# Altium project LEAKCAM.PrjPcb (part 1 of 2)
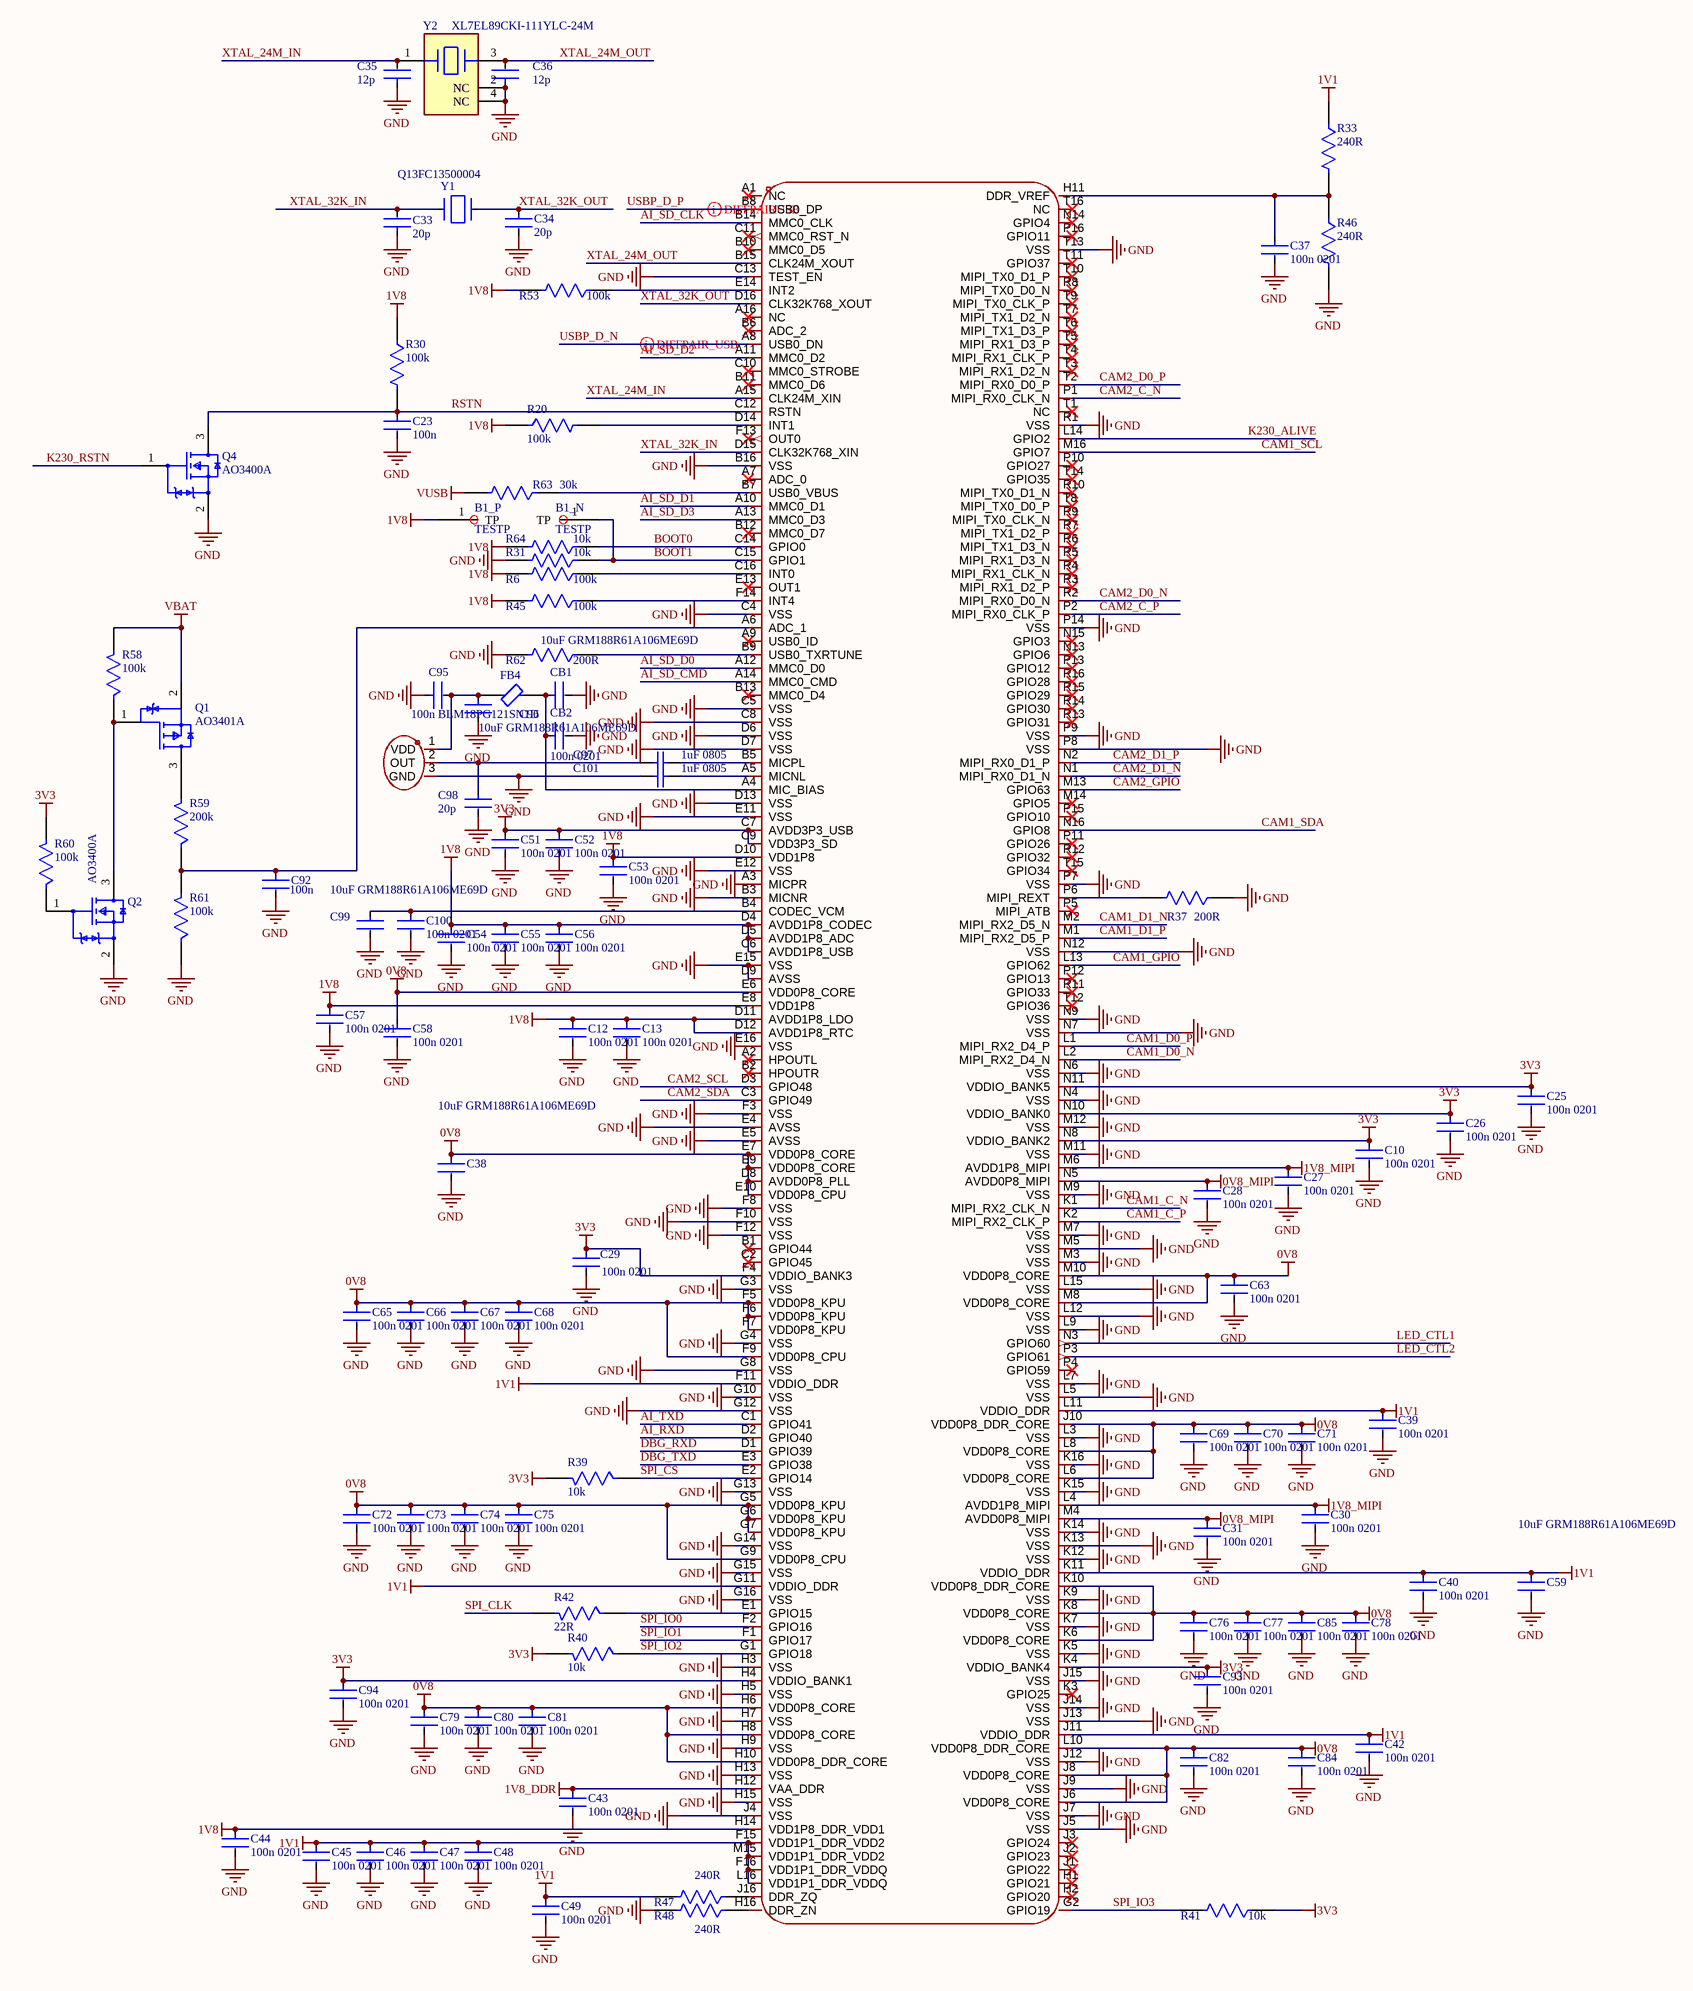
[diagram p0: LEAKCAM.SchDoc]
8 sheets, 269 parts. Net scope: global (net labels, ports and power ports of the same name join across sheets).
Board file: MIFA.PcbDoc
Sheets:
  LEAKCAM.SchDoc
  POWER.SchDoc
  FLASH.SchDoc
  DBG.SchDoc
  CAM.SchDoc
  WIFI.SchDoc
  LEDS.SchDoc
  SENS.SchDoc

## Sheet LEAKCAM.SchDoc
size A2; SheetNumber: 1; SheetTotal: 8

### Parts
B1_N  TESTP  [TESTP]
B1_P  TESTP  [TESTP]
C10  100n 0201  [CAP_0201]
C12  100n 0201  [CAP_0201]
C13  100n 0201  [CAP_0201]
C23  100n  [CAP_0402]
C25  100n 0201  [CAP_0201]
C26  100n 0201  [CAP_0201]
C27  100n 0201  [CAP_0201]
C28  100n 0201  [CAP_0201]
C29  100n 0201  [CAP_0201]
C30  100n 0201  [CAP_0201]
C31  100n 0201  [CAP_0201]
C33  20p  [CAP_0402]
C34  20p  [CAP_0402]
C35  12p  [CAP_0402]
C36  12p  [CAP_0402]
C37  100n 0201  [CAP_0201]
C38  10uF GRM188R61A106ME69D  [FP-GRM188-0_15-MFG]
C39  100n 0201  [CAP_0201]
C40  100n 0201  [CAP_0201]
C42  100n 0201  [CAP_0201]
C43  100n 0201  [CAP_0201]
C44  100n 0201  [CAP_0201]
C45  100n 0201  [CAP_0201]
C46  100n 0201  [CAP_0201]
C47  100n 0201  [CAP_0201]
C48  100n 0201  [CAP_0201]
C49  100n 0201  [CAP_0201]
C51  100n 0201  [CAP_0201]
C52  100n 0201  [CAP_0201]
C53  100n 0201  [CAP_0201]
C54  100n 0201  [CAP_0201]
C55  100n 0201  [CAP_0201]
C56  100n 0201  [CAP_0201]
C57  100n 0201  [CAP_0201]
C58  100n 0201  [CAP_0201]
C59  10uF GRM188R61A106ME69D  [FP-GRM188-0_15-MFG]
C63  100n 0201  [CAP_0201]
C65  100n 0201  [CAP_0201]
C66  100n 0201  [CAP_0201]
C67  100n 0201  [CAP_0201]
C68  100n 0201  [CAP_0201]
C69  100n 0201  [CAP_0201]
C70  100n 0201  [CAP_0201]
C71  100n 0201  [CAP_0201]
C72  100n 0201  [CAP_0201]
C73  100n 0201  [CAP_0201]
C74  100n 0201  [CAP_0201]
C75  100n 0201  [CAP_0201]
C76  100n 0201  [CAP_0201]
C77  100n 0201  [CAP_0201]
C78  100n 0201  [CAP_0201]
C79  100n 0201  [CAP_0201]
C80  100n 0201  [CAP_0201]
C81  100n 0201  [CAP_0201]
C82  100n 0201  [CAP_0201]
C84  100n 0201  [CAP_0201]
C85  100n 0201  [CAP_0201]
C92  100n  [CAP_0402]
C93  100n 0201  [CAP_0201]
C94  100n 0201  [CAP_0201]
C95  100n  [CAP_0402]
C96  10uF GRM188R61A106ME69D  [FP-GRM188-0_15-MFG]
C97  1uF 0805  [CAPC2013X145X50NL20T20]
C98  20p  [CAP_0402]
C99  10uF GRM188R61A106ME69D  [FP-GRM188-0_15-MFG]
C100  100n 0201  [CAP_0201]
C101  1uF 0805  [CAPC2013X145X50NL20T20]
CB1  10uF GRM188R61A106ME69D  [FP-GRM188-0_15-MFG]
CB2  100n 0201  [CAP_0201]
FB4  BLM18PG121SN1D  [FP-BLM18-0_15-t0_8-IPC_B]
Q1  AO3401A  [FP-SOT23-IPC_B]
Q2  AO3400A  [FP-SOT23-MFG]
Q4  AO3400A  [FP-SOT23-MFG]
R6  100k  [RES_0402]
R20  100k  [RES_0402]
R30  100k  [RES_0402]
R31  10k  [RES_0402]
R33  240R  [RES_0402]
R37  200R  [RES_0402]
R39  10k  [RES_0402]
R40  10k  [RES_0402]
R41  10k  [RES_0402]
R42  22R  [RES_0402]
R45  100k  [RES_0402]
R46  240R  [RES_0402]
R47  240R  [RES_0402]
R48  240R  [RES_0402]
R53  100k  [RES_0402]
R58  100k  [RES_0402]
R59  200k  [RES_0402]
R60  100k  [RES_0402]
R61  100k  [RES_0402]
R62  200R  [RES_0402]
R63  30k  [RES_0402]
R64  10k  [RES_0402]
U3  k230d  [K230D]  (value not drawn)
U13  msm381acb026  [mems]  (value not drawn)
Y1  Q13FC13500004  [FP-ABS07-MFG]
Y2  XL7EL89CKI-111YLC-24M  [FP-XRCGB_F_N-MFG]

### Nets
0V8: C38.1 C58.1 C63.1 C65.1 C66.1 C67.1 C68.1 C69.1 C70.1 C71.1 C72.1 C73.1 C74.1 C75.1 C76.1 C77.1 C78.1 C79.1 C80.1 C81.1 C82.1 C84.1 C85.1 U3.D8(AVDD0P8_PLL) U3.E6(VDD0P8_CORE) U3.E7(VDD0P8_CORE) U3.E9(VDD0P8_CORE) U3.E10(VDD0P8_CPU) U3.F5(VDD0P8_KPU) U3.F6(VDD0P8_KPU) U3.F7(VDD0P8_KPU) U3.F9(VDD0P8_CPU) U3.G5(VDD0P8_KPU) U3.G6(VDD0P8_KPU) U3.G7(VDD0P8_KPU) U3.G9(VDD0P8_CPU) U3.H6(VDD0P8_CORE) U3.H8(VDD0P8_CORE) U3.H10(VDD0P8_DDR_CORE) U3.J6(VDD0P8_CORE) U3.J8(VDD0P8_CORE) U3.J10(VDD0P8_DDR_CORE) U3.K6(VDD0P8_CORE) U3.K8(VDD0P8_CORE) U3.K10(VDD0P8_DDR_CORE) U3.L6(VDD0P8_CORE) U3.L8(VDD0P8_CORE) U3.L10(VDD0P8_DDR_CORE) U3.M8(VDD0P8_CORE) U3.M10(VDD0P8_CORE)
0V8_MIPI: C28.1 C31.1 U3.M4(AVDD0P8_MIPI) U3.N5(AVDD0P8_MIPI)
1V1: C39.1 C40.1 C42.1 C45.1 C46.1 C47.1 C48.1 C49.1 C59.1 R33.1 R47.2 U3.F11(VDDIO_DDR) U3.F15(VDD1P1_DDR_VDD2) U3.F16(VDD1P1_DDR_VDDQ) U3.G11(VDDIO_DDR) U3.J11(VDDIO_DDR) U3.K11(VDDIO_DDR) U3.L11(VDDIO_DDR) U3.L16(VDD1P1_DDR_VDDQ) U3.M15(VDD1P1_DDR_VDD2)
1V8: B1_P.1(TP) C12.1 C13.1 C44.1 C53.1 C54.1 C55.1 C56.1 C57.1 R6.2 R20.1 R30.1 R45.2 R53.2 R64.2 U3.C6(AVDD1P8_USB) U3.D4(AVDD1P8_CODEC) U3.D5(AVDD1P8_ADC) U3.D10(VDD1P8) U3.D11(AVDD1P8_LDO) U3.D12(AVDD1P8_RTC) U3.E8(VDD1P8) U3.H14(VDD1P8_DDR_VDD1)
1V8_DDR: C43.1 U3.H12(VAA_DDR)
1V8_MIPI: C27.1 C30.1 U3.L4(AVDD1P8_MIPI) U3.M6(AVDD1P8_MIPI)
3V3: C10.1 C25.1 C26.1 C29.1 C51.1 C52.1 C93.1 C94.1 R39.2 R40.2 R41.1 R60.2 U3.C7(AVDD3P3_USB) U3.C9(VDD3P3_SD) U3.F4(VDDIO_BANK3) U3.H4(VDDIO_BANK1) U3.K4(VDDIO_BANK4) U3.N8(VDDIO_BANK2) U3.N10(VDDIO_BANK0) U3.N11(VDDIO_BANK5)
GND: C10.2 C12.2 C13.2 C23.2 C25.2 C26.2 C27.2 C28.2 C29.2 C30.2 C31.2 C33.1 C34.2 C35.1 C36.1 C37.2 C38.2 C39.2 C40.2 C42.2 C43.2 C44.2 C45.2 C46.2 C47.2 C48.2 C49.2 C51.2 C52.2 C53.2 C54.2 C55.2 C56.2 C57.2 C58.2 C59.2 C63.2 C65.2 C66.2 C67.2 C68.2 C69.2 C70.2 C71.2 C72.2 C73.2 C74.2 C75.2 C76.2 C77.2 C78.2 C79.2 C80.2 C81.2 C82.2 C84.2 C85.2 C92.2 C93.2 C94.2 C95.1 C96.2 C98.2 C99.2 C100.2 C101.1 CB1.2 CB2.2 Q2.2(S) Q4.2(S) R31.2 R37.1 R46.2 R48.2 R61.1 R62.2 U3.A3(MICPR) U3.B3(MICNR) U3.B16(VSS) U3.C4(VSS) U3.C5(VSS) U3.C8(VSS) U3.C13(TEST_EN) U3.D6(VSS) U3.D7(VSS) U3.D9(AVSS) U3.D13(VSS) U3.E4(AVSS) U3.E5(AVSS) U3.E11(VSS) U3.E12(VSS) U3.E15(VSS) U3.E16(VSS) U3.F3(VSS) U3.F8(VSS) U3.F10(VSS) U3.F12(VSS) U3.G3(VSS) U3.G4(VSS) U3.G8(VSS) U3.G10(VSS) U3.G12(VSS) U3.G13(VSS) U3.G14(VSS) U3.G15(VSS) U3.G16(VSS) U3.H3(VSS) U3.H5(VSS) U3.H7(VSS) U3.H9(VSS) U3.H13(VSS) U3.H15(VSS) U3.J4(VSS) U3.J5(VSS) U3.J7(VSS) U3.J9(VSS) U3.J12(VSS) U3.J13(VSS) U3.J14(VSS) U3.J15(VSS) U3.K5(VSS) U3.K7(VSS) U3.K9(VSS) U3.K12(VSS) U3.K13(VSS) U3.K14(VSS) U3.K15(VSS) U3.K16(VSS) U3.L3(VSS) U3.L5(VSS) U3.L7(VSS) U3.L9(VSS) U3.L12(VSS) U3.L15(VSS) U3.M3(VSS) U3.M5(VSS) U3.M7(VSS) U3.M9(VSS) U3.M11(VSS) U3.M12(VSS) U3.N4(VSS) U3.N6(VSS) U3.N7(VSS) U3.N9(VSS) U3.N12(VSS) U3.P7(VSS) U3.P8(VSS) U3.P9(VSS) U3.P14(VSS) U3.R1(VSS) U3.T13(VSS) U13.3(GND) Y2.2(NC) Y2.4(NC)
VBAT: Q1.2(S) R58.2
VUSB: R63.2
AI_RXD: U3.D2(GPIO40)
AI_SD_CLK: U3.B14(MMC0_CLK)
AI_SD_CMD: U3.A14(MMC0_CMD)
AI_SD_D0: U3.A12(MMC0_D0)
AI_SD_D1: U3.A10(MMC0_D1)
AI_SD_D2: U3.A11(MMC0_D2)
AI_SD_D3: U3.A13(MMC0_D3)
AI_TXD: U3.C1(GPIO41)
BOOT0: R64.1 U3.C14(GPIO0)
BOOT1: B1_N.1(TP) R31.1 U3.C15(GPIO1)
CAM1_C_N: U3.K1(MIPI_RX2_CLK_N)
CAM1_C_P: U3.K2(MIPI_RX2_CLK_P)
CAM1_D0_N: U3.L2(MIPI_RX2_D4_N)
CAM1_D0_P: U3.L1(MIPI_RX2_D4_P)
CAM1_D1_N: U3.M2(MIPI_RX2_D5_N)
CAM1_D1_P: U3.M1(MIPI_RX2_D5_P)
CAM1_GPIO: U3.L13(GPIO62)
CAM1_SCL: U3.M16(GPIO7)
CAM1_SDA: U3.N16(GPIO8)
CAM2_C_N: U3.P1(MIPI_RX0_CLK_N)
CAM2_C_P: U3.P2(MIPI_RX0_CLK_P)
CAM2_D0_N: U3.R2(MIPI_RX0_D0_N)
CAM2_D0_P: U3.T2(MIPI_RX0_D0_P)
CAM2_D1_N: U3.N1(MIPI_RX0_D1_N)
CAM2_D1_P: U3.N2(MIPI_RX0_D1_P)
CAM2_GPIO: U3.M13(GPIO63)
CAM2_SCL: U3.D3(GPIO48)
CAM2_SDA: U3.C3(GPIO49)
DBG_RXD: U3.D1(GPIO39)
DBG_TXD: U3.E3(GPIO38)
K230_ALIVE: U3.L14(GPIO2)
K230_RSTN: Q4.1(G)
LED_CTL1: U3.N3(GPIO60)
LED_CTL2: U3.P3(GPIO61)
RSTN: C23.1 Q4.3(D) R30.2 U3.C12(RSTN)
SPI_CLK: R42.2
SPI_CS: R39.1 U3.E2(GPIO14)
SPI_IO0: U3.F2(GPIO16)
SPI_IO1: U3.F1(GPIO17)
SPI_IO2: R40.1 U3.G1(GPIO18)
SPI_IO3: R41.2 U3.G2(GPIO19)
USBP_D_N: U3.A8(USB0_DN)
USBP_D_P: U3.B8(USB0_DP)
XTAL_24M_IN: C35.2 U3.A15(CLK24M_XIN) Y2.1(1_Input/Output)
XTAL_24M_OUT: C36.2 U3.B15(CLK24M_XOUT) Y2.3(2_Input/Output)
XTAL_32K_IN: C33.2 U3.D15(CLK32K768_XIN) Y1.1
XTAL_32K_OUT: C34.1 U3.D16(CLK32K768_XOUT) Y1.2
NetC37_1: C37.1 R33.2 R46.1 U3.H11(DDR_VREF)
NetC92_1: C92.1 R59.1 R61.2 U3.A6(ADC_1)
NetC95_2: C95.2 C96.1 FB4.1 U13.1(VDD)
NetC97_1: C97.1 C98.1 U13.2(OUT)
NetC97_2: C97.2 U3.B5(MICPL)
NetC99_1: C99.1 C100.1 U3.B4(CODEC_VCM)
NetC101_2: C101.2 U3.A5(MICNL)
NetCB1_1: CB1.1 CB2.1 FB4.2 U3.A4(MIC_BIAS)
NetQ1_1: Q1.1(G) Q2.3(D) R58.1
NetQ1_3: Q1.3(D) R59.2
NetQ2_1: Q2.1(G) R60.1
NetR6_1: R6.1 U3.C16(INT0)
NetR20_2: R20.2 U3.D14(INT1)
NetR37_2: R37.2 U3.P6(MIPI_REXT)
NetR42_1: R42.1 U3.E1(GPIO15)
NetR45_1: R45.1 U3.F14(INT4)
NetR47_1: R47.1 U3.J16(DDR_ZQ)
NetR48_1: R48.1 U3.H16(DDR_ZN)
NetR53_1: R53.1 U3.E14(INT2)
NetR62_1: R62.1 U3.B9(USB0_TXRTUNE)
NetR63_1: R63.1 U3.B7(USB0_VBUS)

Not connected (* = marked no-connect by the designer): U3 A1(NC)* A2(HPOUTL)* A7(ADC_0)* A9(USB0_ID)* A16(NC)* B1(GPIO44)* B2(HPOUTR)* B6(ADC_2)* B10(MMC0_D5)* B11(MMC0_D6)* B12(MMC0_D7)* B13(MMC0_D4)* C2(GPIO45)* C10(MMC0_STROBE)* C11(MMC0_RST_N)* E13(OUT1)* F13(OUT0)* H1(GPIO21)* H2(GPIO20)* J1(GPIO22)* J2(GPIO23)* J3(GPIO24)* K3(GPIO25)* M14(GPIO5)* N13(GPIO6)* N14(GPIO4)* N15(GPIO3)* P4(GPIO59)* P5(MIPI_ATB)* P10(GPIO27)* P11(GPIO26)* P12(GPIO13)* P13(GPIO12)* P15(GPIO10)* P16(GPIO11)* R3(MIPI_RX1_D2_P)* R4(MIPI_RX1_CLK_N)* R5(MIPI_RX1_D3_N)* R6(MIPI_TX1_D3_N)* R7(MIPI_TX1_D2_P)* R8(MIPI_TX0_D0_N)* R9(MIPI_TX0_CLK_N)* R10(MIPI_TX0_D1_N)* R11(GPIO33)* R12(GPIO32)* R13(GPIO31)* R14(GPIO30)* R15(GPIO29)* R16(GPIO28)* T1(NC)* T3(MIPI_RX1_D2_N)* T4(MIPI_RX1_CLK_P)* T5(MIPI_RX1_D3_P)* T6(MIPI_TX1_D3_P)* T7(MIPI_TX1_D2_N)* T8(MIPI_TX0_D0_P)* T9(MIPI_TX0_CLK_P)* T10(MIPI_TX0_D1_P)* T11(GPIO37)* T12(GPIO36)* T14(GPIO35)* T15(GPIO34)* T16(NC)*

### Layout directives
differential pair; differential pair class USB: USBP_D_N, USBP_D_P

### Library data of the parts
C10 C12 C13 C25-C31 C37 C39 C40 C42-C49 C51-C58 C63 C65-C82 C84 C85 C93 C94 C100 = CMP-03422-001116-1: C2903663; Manufacturer: Yageo; Manufacturer Part Number: CC0201KRX5R7BB223; Material: Ceramic; Tolerance: 0.1; Temperature Coefficient: 15%; Temperature Characteristic: X5R; Value: 100nF; Voltage Rating: 16 V; Automotive: No; Device Class L1: Passive Components; Lead Free: Yes; ComponentLink2URL: http://www.yageo.com/documents/recent/UPY-GPHC_X5R_4V-to-50V_25.pdf; RoHS: TRUE; Height: 0.33mm; Capacitance: 100nF; Package: CC0201-BA; Temperature Range Low: -55°C; Footprint Url: http://www.yageo.com/exep/pages/download/literatures/UPY-C_GEN_24.pdf; Temperature Range High: +85°C; ComponentLink2Description: Datasheet; Device Class L3: Ceramic Capacitors; Ipc Land Pattern Name: CAPC6030X30; Temperature: -55°C to +85°C; Category: Cap; Device Class L2: Capacitors; Octopart: https://octopart.com/cc0201krx5r7bb223-yageo-90326712
C23 C92 C95 = CMP-03422-001116-1: C307331; Tolerance: 10%; Voltage Rating: 50V; Capacitance: 100nF; Value: 100nF; Max Operating Temperature: 125°C; Case Code (Metric): 1005; RoHS Compliant: Yes; Series: -; Case Code (Imperial): 0402; Min Operating Temperature: -55°C; Mount: Surface Mount; Case/Package: 0402; Packaging: Cut Tape
C33 C34 C98 = CMP-03422-001116-1: C1554; Tolerance: 10%; Voltage Rating: 50V; Capacitance: 20pF; Value: 20pF; Max Operating Temperature: 125°C; Case Code (Metric): 1005; RoHS Compliant: Yes; Series: -; Case Code (Imperial): 0402; Min Operating Temperature: -55°C; Mount: Surface Mount; Case/Package: 0402; Packaging: Cut Tape
C35 C36 = CMP-03422-001116-1: C1547; Tolerance: 10%; Voltage Rating: 50V; Capacitance: 12pF; Value: 12pF; Max Operating Temperature: 125°C; Case Code (Metric): 1005; RoHS Compliant: Yes; Series: -; Case Code (Imperial): 0402; Min Operating Temperature: -55°C; Mount: Surface Mount; Case/Package: 0402; Packaging: Cut Tape
C38 C59 C96 C99 = CMP-06035-003612-1: C19702; Tolerance: 20%; Dielectric: X5R; Voltage Rating: 10V; Material: Ceramic; Package Quantity: 4000; Width: 0.8mm; Case/Package: 0603; Thickness: 0.035inch; Capacitance: 10uF; Voltage Rating (DC): 10V; Termination: SMD/SMT; Length: 1.6mm; Lead Free: Lead Free; Mount: Surface Mount; Height: 0.8mm; Depth: 0.8mm; Packaging: Tape and Reel; Weight: 0.000222oz; Min Operating Temperature: -55°C; Case Code (Metric): 1608; Max Operating Temperature: 85°C; Case Code (Imperial): 0603; Value: 10uF
C97 C101 = CMP-2007-01676-1: C28323; Part Number: VJ0805Y105KXQRW1BC; Manufacturer: Vitramon; Value: 1uF; Capacitance: 1uF
CB1 = CMP-06035-003612-1: C19702; Tolerance: 20%; Dielectric: X5R; Voltage Rating: 10V; Package Quantity: 4000; Width: 0.8mm; Case/Package: 0603; Thickness: 0.035inch; Capacitance: 10uF; Voltage Rating (DC): 10V; Termination: SMD/SMT; Length: 1.6mm; Lead Free: Lead Free; Mount: Surface Mount; Height: 0.8mm; Depth: 0.8mm; Packaging: Tape and Reel; Weight: 0.000222oz; Min Operating Temperature: -55°C; Case Code (Metric): 1608; Max Operating Temperature: 85°C; Case Code (Imperial): 0603; Material: Ceramic; Value: 10uF
CB2 = CMP-03422-001116-1: C2903663; Manufacturer: Yageo; Manufacturer Part Number: CC0201KRX5R7BB223; Tolerance: 0.1; Temperature Coefficient: 15%; Temperature Characteristic: X5R; Value: 100nF; Voltage Rating: 16 V; Material: Ceramic; Automotive: No; Device Class L1: Passive Components; Lead Free: Yes; ComponentLink2URL: http://www.yageo.com/documents/recent/UPY-GPHC_X5R_4V-to-50V_25.pdf; RoHS: TRUE; Height: 0.33mm; Capacitance: 100nF; Package: CC0201-BA; Temperature Range Low: -55°C; Footprint Url: http://www.yageo.com/exep/pages/download/literatures/UPY-C_GEN_24.pdf; Temperature Range High: +85°C; ComponentLink2Description: Datasheet; Device Class L3: Ceramic Capacitors; Ipc Land Pattern Name: CAPC6030X30; Temperature: -55°C to +85°C; Category: Cap; Device Class L2: Capacitors; Octopart: https://octopart.com/cc0201krx5r7bb223-yageo-90326712
FB4 = CMP-0686-00439-3: C14709; DC Resistance (DCR): 180mR; Number of Lines: 1; Current Rating: 500mA; Material: Steel; Core Material: Ferrite; Impedance: 120R; Tolerance: 25%; Test Frequency: 100MHz; Shielding: Unshielded; Case/Package: 0603; Max Operating Temperature: 125°C; Min Operating Temperature: -55°C; Series: BLM18A; Case Code (Metric): 1608; DC Resistance-Max: 180mR; Package Quantity: 1; Radiation Hardening: No; Length: 1.6mm; Lead Free: Lead Free; Max DC Current: 500mA; Termination: SMD/SMT; Number of Pins: 2; Military Standard: Not; REACH SVHC: No SVHC; Number of Circuits: 1; Max Current Rating: 500mA; Depth: 0.8mm; Frequency: 100MHz; Width: 0.8mm; Case Code (Imperial): 0603; DC Current: 500mA; Height: 0.8mm; RoHS Compliant: Yes; Packaging: Tape and Reel
Q1 = CMP-12801-000081-1: C15127; Continuous Drain Current (ID): 2.4A; Rds On Max: 160mR; Input Capacitance: 156pF; Drain to Source Voltage (Vdss): 20V; Max Power Dissipation: 840mW; Max Operating Temperature: 150°C; Packaging: Tape and Reel; Case/Package: TO-236-3; Min Operating Temperature: -55°C; Mount: Surface Mount
Q2 Q4 = CMP-12801-000001-1: C20917; Manufacturer Part Number: DMG2302UK-7; Manufacturer: Diodes Inc.; Reverse Recovery Time: 5.3ns; Gate Charge At Vgs: 2.8nC @ 10V; Drain To Source Voltage: 20V; Turn On Delay Time: 0.6ns; Pulse Drain Current: 12A; Max Forward Diode Voltage: 1.2V; Reverse Recovery Charge: 0.5nC; Automotive Grade: Grade 0; Threshold Vgs Min: 0.3V; Number Of N Channels: 1; Standoff Height: 0.013mm; Typ Forward Diode Voltage: 0.7V; Continuous Drain Current: 2.8A; Drain To Source Resistance: 61mΩ; Rthja Max: 192°C/W; Max Junction Temp: +150°C; Input Capacitace At Vds: 130pF @ 10V; Threshold Vgs Max: 1V; Turn Off Delay Time: 4.2ns; Depletion Mode: False; Gate To Source Voltage: 12V; Power Dissipation: 0.66W; Device Class L1: Discrete Semiconductors; Footprint Url: https://www.diodes.com/assets/Package-Files/SOT23.pdf; Lead Free: Yes; Temperature Range High: +150°C; Category: Trans; Digikey Description: MOSFET N-CH 20V 2.8A SOT23; RoHS: TRUE; Device Class L2: Transistors; Height: 1.1mm; Automotive: Yes; Package: SOT23; Drain To Source Breakdown Voltage: 20V; ComponentLink2Description: Datasheet; Device Class L3: MOSFETs; Octopart: https://octopart.com/dmg2302uk-7-diodes+inc.-73850182; Temperature Range Low: -55°C; Temperature: -55°C to +150°C; Number Of Channels: 1; ComponentLink2URL: https://www.diodes.com/assets/Datasheets/DMG2302UK.pdf
R6 R20 R30 R45 R53 R58 R60 R61 = CMP-03412-016018-1: C25741; Tolerance: 1%; Temperature Coefficient: 100ppm/°C; Resistance: 100kOhm; Max Power Dissipation: 63mW; Value: 100kOhm; Ratings: AEC-Q200; Resistor Type: Thick Film; Number of Terminations: 2; RoHS Compliant: Yes; Min Operating Temperature: -55°C; Case/Package: 0402; Series: AC; Length: 0.039inch; Width: 0.02inch; Features: Moisture Resistant; Height: 0.015inch; Packaging: Tape and Reel; Max Operating Temperature: 155°C
R31 R39-R41 R64 = CMP-03412-016018-1: C25744; Tolerance: 1%; Temperature Coefficient: 100ppm/°C; Resistance: 10kOhm; Max Power Dissipation: 63mW; Value: 10kOhm; Ratings: AEC-Q200; Resistor Type: Thick Film; Number of Terminations: 2; RoHS Compliant: Yes; Min Operating Temperature: -55°C; Case/Package: 0402; Series: AC; Length: 0.039inch; Width: 0.02inch; Features: Moisture Resistant; Height: 0.015inch; Packaging: Tape and Reel; Max Operating Temperature: 155°C
R33 R46-R48 = CMP-03412-016018-1: C324768; Tolerance: 1%; Temperature Coefficient: 100ppm/°C; Resistance: 240Ohm; Max Power Dissipation: 63mW; Value: 240Ohm; Ratings: AEC-Q200; Resistor Type: Thick Film; Number of Terminations: 2; RoHS Compliant: Yes; Min Operating Temperature: -55°C; Case/Package: 0402; Series: AC; Length: 0.039inch; Width: 0.02inch; Features: Moisture Resistant; Height: 0.015inch; Packaging: Tape and Reel; Max Operating Temperature: 155°C
R37 R62 = CMP-03412-016018-1: C25087; Tolerance: 1%; Temperature Coefficient: 100ppm/°C; Resistance: 200Ohm; Max Power Dissipation: 63mW; Value: 200Ohm; Ratings: AEC-Q200; Resistor Type: Thick Film; Number of Terminations: 2; RoHS Compliant: Yes; Min Operating Temperature: -55°C; Case/Package: 0402; Series: AC; Length: 0.039inch; Width: 0.02inch; Features: Moisture Resistant; Height: 0.015inch; Packaging: Tape and Reel; Max Operating Temperature: 155°C
R42 = CMP-03412-016018-1: C25092; Tolerance: 1%; Temperature Coefficient: 100ppm/°C; Resistance: 22Ohm; Max Power Dissipation: 63mW; Value: 22Ohm; Ratings: AEC-Q200; Resistor Type: Thick Film; Number of Terminations: 2; RoHS Compliant: Yes; Min Operating Temperature: -55°C; Case/Package: 0402; Series: AC; Length: 0.039inch; Width: 0.02inch; Features: Moisture Resistant; Height: 0.015inch; Packaging: Tape and Reel; Max Operating Temperature: 155°C
R59 = CMP-03412-016018-1: C25764; Tolerance: 1%; Temperature Coefficient: 100ppm/°C; Resistance: 200kOhm; Max Power Dissipation: 63mW; Value: 200kOhm; Ratings: AEC-Q200; Resistor Type: Thick Film; Number of Terminations: 2; RoHS Compliant: Yes; Min Operating Temperature: -55°C; Case/Package: 0402; Series: AC; Length: 0.039inch; Width: 0.02inch; Features: Moisture Resistant; Height: 0.015inch; Packaging: Tape and Reel; Max Operating Temperature: 155°C
R63 = CMP-03412-016018-1: C49653548; Tolerance: 1%; Temperature Coefficient: 100ppm/°C; Resistance: 30kOhm; Max Power Dissipation: 63mW; Value: 30kOhm; Ratings: AEC-Q200; Resistor Type: Thick Film; Number of Terminations: 2; RoHS Compliant: Yes; Min Operating Temperature: -55°C; Case/Package: 0402; Series: AC; Length: 0.039inch; Width: 0.02inch; Features: Moisture Resistant; Height: 0.015inch; Packaging: Tape and Reel; Max Operating Temperature: 155°C
U3 = k230d: C42414902; Manufacturer: Canaan(嘉楠); AddInBom: yes; ModelId: 5e2811f3a7254058be5ff42f0a018083; ModelName: BGA-256_L11.0-W11.0-P0.65-BL; ModelTransform: 433.07,433.07,0,90,0,0,0,0,0; Symbol: K230D; LCSC Part Name: K230平台及其特性; SupplierPart: C42414902; ManufacturerPart: K230D; Supplier Footprint: BGA-256; JLCPCB Part Class: Extended Part; Datasheet: https://item.szlcsc.com/datasheet/K230D/44408979.html; Supplier: LCSC; ConvertToPcb: yes; FootprintName: BGA-256_L11.0-W11.0-P0.65-BL; Features: Calendar function；Power-on reset (POR)；True random number generator (TRNG)；Watchdog reset；Built-in general-purpose timer；Hardware CRC；Software reset
U13 = msm381acb026: C51928208; Manufacturer: MEMS(敏芯微); AddInBom: yes; Direction: Omnidirectional; Voltage - Supply: 3.6V; Current Consumption: 175uA; S/N Ratio: 64dB; Sensitivity: -38dB; Impedance: 170Ω; Output Type: Analog output; Symbol: MSM381ACB026; LCSC Part Name: 3.6V -38dB; SupplierPart: C51928208; ManufacturerPart: MSM381ACB026; Supplier Footprint: LGA-3(1.9x2.8); JLCPCB Part Class: Extended Part; Datasheet: https://item.szlcsc.com/datasheet/MSM381ACB026/54640763.html; Supplier: LCSC; ConvertToPcb: yes; FootprintName: MIC-SMD_L2.8-W1.9_MSM381ACB026; Length: 2.75mm; Width: 1.85mm; Height: 0.9mm; Features: Omnidirectional pickup
Y1 = CMP-0447-00001-4: C32346; Frequency: 32.768kHz; ESR (Equivalent Series Resistance): 70kR; Frequency Tolerance: 20ppm; Load Capacitance: 12.5pF; Operating Frequency: 32.768 kHz; Radiation Hardening: No; Length: 3.2mm; Max Operating Temperature: 85°C; Number of Pins: 2; Series: ABS07; Min Operating Temperature: -40°C; Packaging: Tape and Reel; Height: 0.9mm; Width: 1.5mm; Depth: 1.5mm; RoHS Compliant: Yes; Tolerance: 20ppm; Termination: SMD/SMT; Lead Free: Lead Free; Series Resistance: 70kR; REACH SVHC: No SVHC; Case/Package: CSMD; Package Quantity: 3000
Y2 = CMP-06054-000017-1: C2965580; ESR (Equivalent Series Resistance): 150R; Operating Frequency: 24 MHz; Tolerance: 30ppm; Frequency: 24MHz; Load Capacitance: 6pF; Frequency Stability: 40ppm; Length: 2mm; Height: 0.028inch; Lead Free: Lead Free; Min Operating Temperature: -30°C; REACH SVHC: No SVHC; RoHS Compliant: Yes; Series Resistance: 150R; Mount: Surface Mount; Packaging: Tape and Reel; Termination: SMD/SMT; Case/Package: SMD/SMT; Max Operating Temperature: 85°C; Width: 1.6mm; Number of Pins: 4; Package Quantity: 1; Depth: 1.6mm; Frequency Tolerance: 30ppm; Series: XRCGB

## Sheet POWER.SchDoc
size A2; SheetNumber: 2; SheetTotal: 8
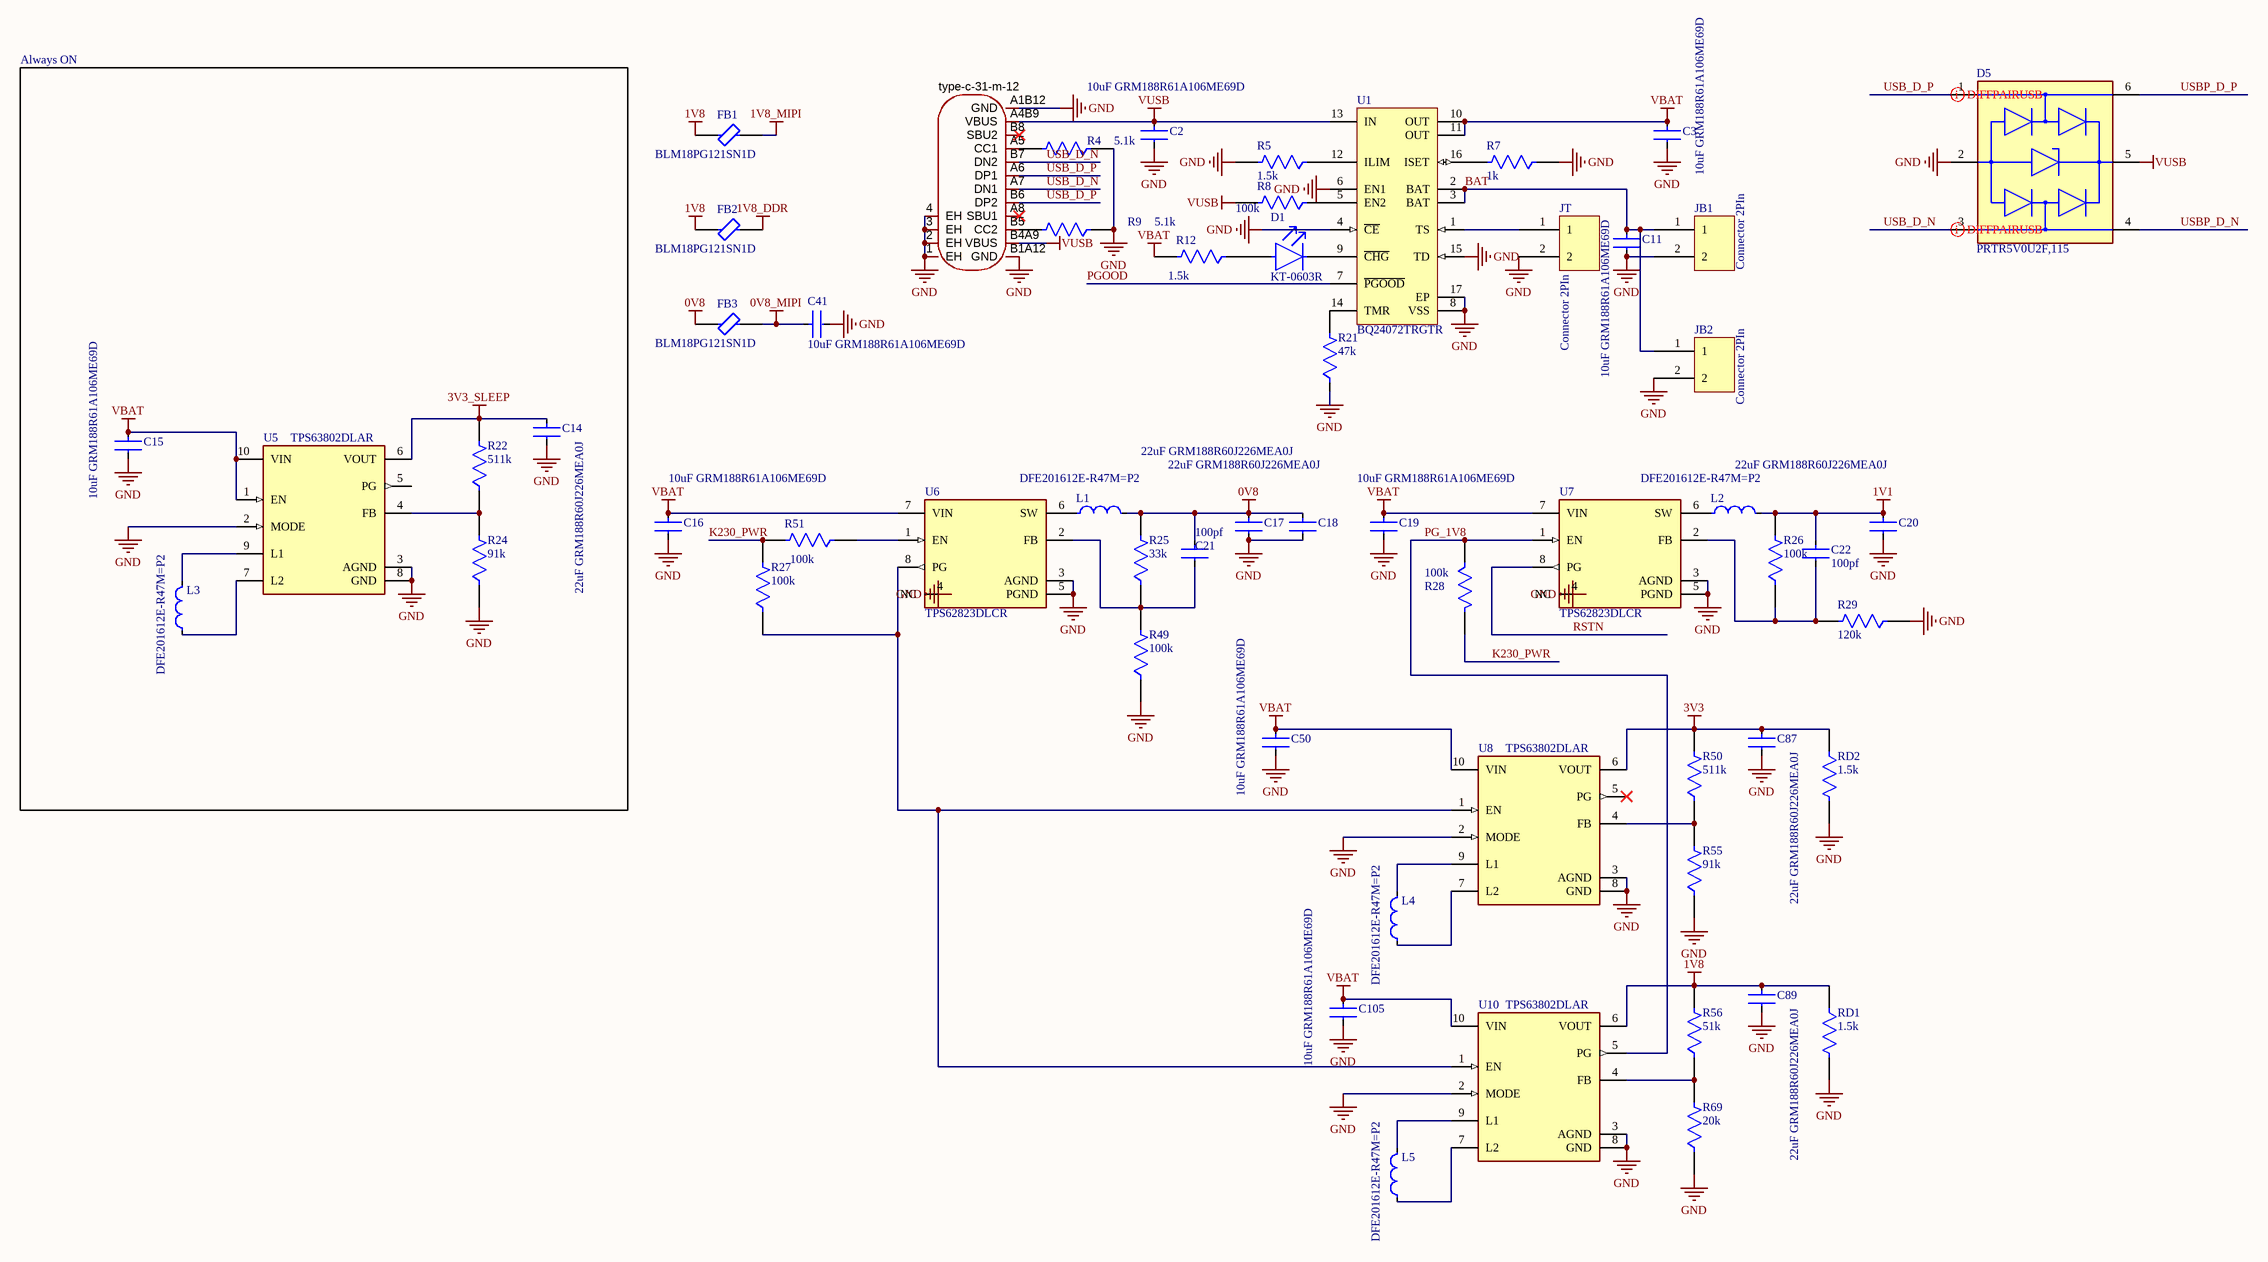
[diagram p1: POWER.SchDoc]

### Parts
C2  10uF GRM188R61A106ME69D  [FP-GRM188-0_15-MFG]
C3  10uF GRM188R61A106ME69D  [FP-GRM188-0_15-MFG]
C11  10uF GRM188R61A106ME69D  [FP-GRM188-0_15-MFG]
C14  22uF GRM188R60J226MEA0J  [FP-GRM188-0_2-IPC_C]
C15  10uF GRM188R61A106ME69D  [FP-GRM188-0_15-MFG]
C16  10uF GRM188R61A106ME69D  [FP-GRM188-0_15-MFG]
C17  22uF GRM188R60J226MEA0J  [FP-GRM188-0_2-IPC_C]
C18  22uF GRM188R60J226MEA0J  [FP-GRM188-0_2-IPC_C]
C19  10uF GRM188R61A106ME69D  [FP-GRM188-0_15-MFG]
C20  22uF GRM188R60J226MEA0J  [FP-GRM188-0_2-IPC_C]
C21  100pf  [CAP_0402]
C22  100pf  [CAP_0402]
C41  10uF GRM188R61A106ME69D  [FP-GRM188-0_15-MFG]
C50  10uF GRM188R61A106ME69D  [FP-GRM188-0_15-MFG]
C87  22uF GRM188R60J226MEA0J  [FP-GRM188-0_2-IPC_C]
C89  22uF GRM188R60J226MEA0J  [FP-GRM188-0_2-IPC_C]
C105  10uF GRM188R61A106ME69D  [FP-GRM188-0_15-MFG]
D1  KT-0603R  [FP-SML-LX0603IW-TR-MFG]
D5  PRTR5V0U2F,115  [FP-SOT886-MFG]
FB1  BLM18PG121SN1D  [FP-BLM18-0_15-t0_8-IPC_B]
FB2  BLM18PG121SN1D  [FP-BLM18-0_15-t0_8-IPC_B]
FB3  BLM18PG121SN1D  [FP-BLM18-0_15-t0_8-IPC_B]
JB1  Connector 2PIn  [CON_2P]
JB2  Connector 2PIn  [CON_2P]
JT  Connector 2PIn  [CON_2P]
L1  DFE201612E-R47M=P2  [FP-DFE201612C-IPC_C]
L2  DFE201612E-R47M=P2  [FP-DFE201612C-IPC_C]
L3  DFE201612E-R47M=P2  [FP-DFE201612C-IPC_C]
L4  DFE201612E-R47M=P2  [FP-DFE201612C-IPC_C]
L5  DFE201612E-R47M=P2  [FP-DFE201612C-IPC_C]
R4  5.1k  [RES_0402]
R5  1.5k  [RES_0402]
R7  1k  [RES_0402]
R8  100k  [RES_0402]
R9  5.1k  [RES_0402]
R12  1.5k  [RES_0402]
R21  47k  [RES_0402]
R22  511k  [RES_0402]
R24  91k  [RES_0402]
R25  33k  [RES_0402]
R26  100k  [RES_0402]
R27  100k  [RES_0402]
R28  100k  [RES_0402]
R29  120k  [RES_0402]
R49  100k  [RES_0402]
R50  511k  [RES_0402]
R51  100k  [RES_0402]
R55  91k  [RES_0402]
R56  51k  [RES_0402]
R69  20k  [RES_0402]
RD1  1.5k  [RES_0402]
RD2  1.5k  [RES_0402]
U1  BQ24072TRGTR  [RGT0016C_V]
U5  TPS63802DLAR  [FP-DLA0010A-MFG]
U6  TPS62823DLCR  [FP-DLC0008A-MFG]
U7  TPS62823DLCR  [FP-DLC0008A-MFG]
U8  TPS63802DLAR  [FP-DLA0010A-MFG]
U10  TPS63802DLAR  [FP-DLA0010A-MFG]
USBC1  type-c-31-m-12  [TYPE-C-31-M-12]

### Blocks framed on the sheet
Always ON: C14 C15 L3 R22 R24 U5

### Nets
0V8: C17.1 C18.1 C21.1 FB3.1 L1.2 R25.2
0V8_MIPI: C41.1 FB3.2
1V1: C20.1 C22.1 L2.2 R26.2
1V8: C89.1 FB1.1 FB2.1 R56.2 RD1.1 U10.6(VOUT)
1V8_DDR: FB2.2
1V8_MIPI: FB1.2
3V3: C87.1 R50.2 RD2.1 U8.6(VOUT)
3V3_SLEEP: C14.1 R22.2 U5.6(VOUT)
GND: C2.2 C3.2 C11.2 C14.2 C15.2 C16.2 C17.2 C18.2 C19.2 C20.2 C41.2 C50.2 C87.2 C89.2 C105.2 D5.2(GND) JB1.2 JB2.2 JT.2 R4.1 R5.2 R7.1 R9.1 R21.1 R24.1 R29.1 R49.1 R55.1 R69.1 RD1.2 RD2.2 U1.4(~{CE}) U1.6(EN1) U1.8(VSS) U1.15(TD) U1.17(EP) U5.2(MODE) U5.3(AGND) U5.8(GND) U6.3(AGND) U6.4(NC) U6.5(PGND) U7.3(AGND) U7.4(NC) U7.5(PGND) U8.2(MODE) U8.3(AGND) U8.8(GND) U10.2(MODE) U10.3(AGND) U10.8(GND) USBC1.1(EH) USBC1.2(EH) USBC1.3(EH) USBC1.4(EH) USBC1.A1B12(GND) USBC1.B1A12(GND)
VBAT: C3.1 C15.1 C16.1 C19.1 C50.1 C105.1 R12.2 U1.10(OUT) U1.11(OUT) U5.1(EN) U5.10(VIN) U6.7(VIN) U7.7(VIN) U8.10(VIN) U10.10(VIN)
VUSB: C2.1 D5.5(VCC) R8.2 U1.13(IN) USBC1.A4B9(VBUS) USBC1.B4A9(VBUS)
BAT: C11.1 JB1.1 JB2.1 U1.2(BAT) U1.3(BAT)
K230_PWR: R27.2 R28.2 R51.2
PG_1V8: R28.1 U7.1(EN) U10.5(PG)
PGOOD: U1.7(~{PGOOD})
RSTN: U7.8(PG)
USB_D_N: D5.3(I/O2) USBC1.A7(DN1) USBC1.B7(DN2)
USB_D_P: D5.1(I/O1) USBC1.A6(DP1) USBC1.B6(DP2)
USBP_D_N: D5.4(I/O2)
USBP_D_P: D5.6(I/O1)
NetC21_2: C21.2 R25.1 R49.2 U6.2(FB)
NetC22_2: C22.2 R26.1 R29.2 U7.2(FB)
NetD1_1: D1.1(C) U1.9(~{CHG})
NetD1_2: D1.2(A) R12.1
NetJT_1: JT.1 U1.1(TS)
NetL1_1: L1.1 U6.6(SW)
NetL2_1: L2.1 U7.6(SW)
NetL3_1: L3.1 U5.7(L2)
NetL3_2: L3.2 U5.9(L1)
NetL4_1: L4.1 U8.7(L2)
NetL4_2: L4.2 U8.9(L1)
NetL5_1: L5.1 U10.7(L2)
NetL5_2: L5.2 U10.9(L1)
NetR4_2: R4.2 USBC1.A5(CC1)
NetR5_1: R5.1 U1.12(ILIM)
NetR7_2: R7.2 U1.16(ISET)
NetR8_1: R8.1 U1.5(EN2)
NetR9_2: R9.2 USBC1.B5(CC2)
NetR21_2: R21.2 U1.14(TMR)
NetR22_1: R22.1 R24.2 U5.4(FB)
NetR27_1: R27.1 U6.8(PG) U8.1(EN) U10.1(EN)
NetR50_1: R50.1 R55.2 U8.4(FB)
NetR51_1: R51.1 U6.1(EN)
NetR56_1: R56.1 R69.2 U10.4(FB)

Not connected (* = marked no-connect by the designer): U5 5(PG); U8 5(PG)*; USBC1 A8(SBU1)* B8(SBU2)*

### Layout directives
differential pair; differential pair class USB: USB_D_N, USB_D_P

### Library data of the parts
C2 C3 C11 C15 C16 C19 C41 C50 C105 = CMP-06035-003612-1: as C38 on sheet LEAKCAM; Package Quantity: 4000; Width: 0.8mm; Case/Package: 0603; Thickness: 0.035inch; Capacitance: 10uF; Voltage Rating (DC): 10V; Termination: SMD/SMT; Length: 1.6mm; Lead Free: Lead Free; Mount: Surface Mount; Height: 0.8mm; Depth: 0.8mm; Packaging: Tape and Reel; Weight: 0.000222oz; Min Operating Temperature: -55°C; Case Code (Metric): 1608; Max Operating Temperature: 85°C; Case Code (Imperial): 0603; Value: 10uF
C14 C17 C18 C20 C87 C89 = CMP-06035-027361-1: C59461; Dielectric: X5R; Voltage Rating: 6.3V; Tolerance: 20%; Capacitance: 22uF; Case Code (Metric): 1608; Thickness: 0.039inch; Termination: SMD/SMT; Voltage Rating (DC): 6.3V; Width: 0.031inch; Weight: 0.000222oz; Case/Package: 0603; Lead Free: Lead Free; Package Quantity: 10000; Case Code (Imperial): 0603; Length: 0.063inch; Packaging: Tape and Reel; Max Operating Temperature: 85°C; Min Operating Temperature: -55°C; Mount: Surface Mount; Value: 22uF
C21 C22 = CMP-03422-001116-1: C1546; Tolerance: 10%; Voltage Rating: 50V; Max Operating Temperature: 125°C; Case Code (Metric): 1005; RoHS Compliant: Yes; Series: -; Case Code (Imperial): 0402; Min Operating Temperature: -55°C; Mount: Surface Mount; Capacitance: 100pF; Case/Package: 0402; Packaging: Cut Tape; Value: 100pF
D1 = CMP-57192-000012-1: C2286; Luminous Intensity: 14mcd; Test Current: 20mA; Color: Red; Viewing Angle: 160°; Approvals: UL; Lens Style: Diffused; Forward Voltage: 2V; Power Dissipation: 50mW; Dominant Wavelength: 635nm; Number of LEDs: 1; Lens Color: White; Height: 0.6mm; RoHS Compliant: Yes; Lead Free: Lead Free; Number of Pins: 2; Packaging: Tape and Reel; Case/Package: 0603; Length: 1.6mm; Max Operating Temperature: 85°C; Illumination Color: Red; Case Code (Metric): 1608; Diameter: 0.061inch; Min Operating Temperature: -25°C; Mount: Surface Mount; Width: 0.8mm; Case Code (Imperial): 0603; Lens Transparency: Diffused; Wavelength: 635nm; Package Quantity: 1; Forward Current: 20mA
D5 = CMP-14436-000003-1: C478118; Manufacturer: Nexperia; Capacitance: 1pF; Reverse Standoff Voltage: 5.5V; Number Of Channels: 2; Automotive Grade: Grade 3; Direction: Unidirectional; Value: 1pF; Breakdown Voltage: 6V; Octopart: https://octopart.com/prtr5v0u2f%2C115-nexperia-78741690; Height: 0.5mm; Category: Diode; RoHS: TRUE; Automotive: Yes; Digikey Description: TVS DIODE 5.5V 6XSON SOT886; Device Class L1: Circuit Protection; Ambient Temperature Range High: +85°C; ComponentLink2Description: Datasheet; Manufacturer Part Number: PRTR5V0U2F,115; Device Class L3: unset; Footprint Url: https://assets.nexperia.com/documents/outline-drawing/SOT886.pdf; Lead Free: Yes; Ambient Temperature Range Low: -40°C; Device Class L2: TVS Diodes; Package: SOT886; ComponentLink2URL: https://assets.nexperia.com/documents/data-sheet/PRTR5V0U2F_PRTR5V0U2K.pdf
FB1-FB3 = CMP-0686-00439-3: as FB4 on sheet LEAKCAM; Case/Package: 0603; Max Operating Temperature: 125°C; Min Operating Temperature: -55°C; Series: BLM18A; Case Code (Metric): 1608; DC Resistance-Max: 180mR; Package Quantity: 1; Radiation Hardening: No; Length: 1.6mm; Lead Free: Lead Free; Max DC Current: 500mA; Termination: SMD/SMT; Number of Pins: 2; Military Standard: Not; REACH SVHC: No SVHC; Number of Circuits: 1; Max Current Rating: 500mA; Depth: 0.8mm; Frequency: 100MHz; Width: 0.8mm; Case Code (Imperial): 0603; DC Current: 500mA; Height: 0.8mm; RoHS Compliant: Yes; Packaging: Tape and Reel
JB1 JB2 JT = CON2P
L1-L5 = CMP-06042-012656-1: C668312; Value: 0.47uH; Inductance: 0.47uH
R4 R9 = CMP-03412-016018-1: C25905; Tolerance: 1%; Temperature Coefficient: 100ppm/°C; Resistance: 5.1kOhm; Max Power Dissipation: 63mW; Value: 5.1kOhm; Ratings: AEC-Q200; Resistor Type: Thick Film; Number of Terminations: 2; RoHS Compliant: Yes; Min Operating Temperature: -55°C; Case/Package: 0402; Series: AC; Length: 0.039inch; Width: 0.02inch; Features: Moisture Resistant; Height: 0.015inch; Packaging: Tape and Reel; Max Operating Temperature: 155°C
R5 R12 RD1 RD2 = CMP-03412-016018-1: C25867; Tolerance: 1%; Temperature Coefficient: 100ppm/°C; Resistance: 1.5kOhm; Max Power Dissipation: 63mW; Value: 1.5kOhm; Ratings: AEC-Q200; Resistor Type: Thick Film; Number of Terminations: 2; RoHS Compliant: Yes; Min Operating Temperature: -55°C; Case/Package: 0402; Series: AC; Length: 0.039inch; Width: 0.02inch; Features: Moisture Resistant; Height: 0.015inch; Packaging: Tape and Reel; Max Operating Temperature: 155°C
R7 = CMP-03412-016018-1: C11702; Tolerance: 1%; Temperature Coefficient: 100ppm/°C; Resistance: 1kOhm; Max Power Dissipation: 63mW; Value: 1kOhm; Ratings: AEC-Q200; Resistor Type: Thick Film; Number of Terminations: 2; RoHS Compliant: Yes; Min Operating Temperature: -55°C; Case/Package: 0402; Series: AC; Length: 0.039inch; Width: 0.02inch; Features: Moisture Resistant; Height: 0.015inch; Packaging: Tape and Reel; Max Operating Temperature: 155°C
R8 R26-R28 R49 R51 = CMP-03412-016018-1: as R6 on sheet LEAKCAM; Ratings: AEC-Q200; Resistor Type: Thick Film; Number of Terminations: 2; RoHS Compliant: Yes; Min Operating Temperature: -55°C; Case/Package: 0402; Series: AC; Length: 0.039inch; Width: 0.02inch; Features: Moisture Resistant; Height: 0.015inch; Packaging: Tape and Reel; Max Operating Temperature: 155°C
R21 = CMP-03412-016018-1: C25792; Tolerance: 1%; Temperature Coefficient: 100ppm/°C; Resistance: 47kOhm; Max Power Dissipation: 63mW; Value: 47kOhm; Ratings: AEC-Q200; Resistor Type: Thick Film; Number of Terminations: 2; RoHS Compliant: Yes; Min Operating Temperature: -55°C; Case/Package: 0402; Series: AC; Length: 0.039inch; Width: 0.02inch; Features: Moisture Resistant; Height: 0.015inch; Packaging: Tape and Reel; Max Operating Temperature: 155°C
R22 R50 = CMP-03412-016018-1: C49655223; Tolerance: 1%; Temperature Coefficient: 100ppm/°C; Resistance: 511kOhm; Max Power Dissipation: 63mW; Value: 511kOhm; Ratings: AEC-Q200; Resistor Type: Thick Film; Number of Terminations: 2; RoHS Compliant: Yes; Min Operating Temperature: -55°C; Case/Package: 0402; Series: AC; Length: 0.039inch; Width: 0.02inch; Features: Moisture Resistant; Height: 0.015inch; Packaging: Tape and Reel; Max Operating Temperature: 155°C
R24 R55 = CMP-03412-016018-1: C54920709; Tolerance: 1%; Temperature Coefficient: 100ppm/°C; Resistance: 91kOhm; Max Power Dissipation: 63mW; Value: 91kOhm; Ratings: AEC-Q200; Resistor Type: Thick Film; Number of Terminations: 2; RoHS Compliant: Yes; Min Operating Temperature: -55°C; Case/Package: 0402; Series: AC; Length: 0.039inch; Width: 0.02inch; Features: Moisture Resistant; Height: 0.015inch; Packaging: Tape and Reel; Max Operating Temperature: 155°C
R25 = CMP-03412-016018-1: C25779; Tolerance: 1%; Temperature Coefficient: 100ppm/°C; Resistance: 33kOhm; Max Power Dissipation: 63mW; Value: 33kOhm; Ratings: AEC-Q200; Resistor Type: Thick Film; Number of Terminations: 2; RoHS Compliant: Yes; Min Operating Temperature: -55°C; Case/Package: 0402; Series: AC; Length: 0.039inch; Width: 0.02inch; Features: Moisture Resistant; Height: 0.015inch; Packaging: Tape and Reel; Max Operating Temperature: 155°C
R29 = CMP-03412-016018-1: C25750; Tolerance: 1%; Temperature Coefficient: 100ppm/°C; Resistance: 120kOhm; Max Power Dissipation: 63mW; Value: 120kOhm; Ratings: AEC-Q200; Resistor Type: Thick Film; Number of Terminations: 2; RoHS Compliant: Yes; Min Operating Temperature: -55°C; Case/Package: 0402; Series: AC; Length: 0.039inch; Width: 0.02inch; Features: Moisture Resistant; Height: 0.015inch; Packaging: Tape and Reel; Max Operating Temperature: 155°C
R56 = CMP-03412-016018-1: C25794; Tolerance: 1%; Temperature Coefficient: 100ppm/°C; Resistance: 51kOhm; Max Power Dissipation: 63mW; Value: 51kOhm; Ratings: AEC-Q200; Resistor Type: Thick Film; Number of Terminations: 2; RoHS Compliant: Yes; Min Operating Temperature: -55°C; Case/Package: 0402; Series: AC; Length: 0.039inch; Width: 0.02inch; Features: Moisture Resistant; Height: 0.015inch; Packaging: Tape and Reel; Max Operating Temperature: 155°C
R69 = CMP-03412-016018-1: C25765; Tolerance: 1%; Temperature Coefficient: 100ppm/°C; Resistance: 20kOhm; Max Power Dissipation: 63mW; Value: 20kOhm; Ratings: AEC-Q200; Resistor Type: Thick Film; Number of Terminations: 2; RoHS Compliant: Yes; Min Operating Temperature: -55°C; Case/Package: 0402; Series: AC; Length: 0.039inch; Width: 0.02inch; Features: Moisture Resistant; Height: 0.015inch; Packaging: Tape and Reel; Max Operating Temperature: 155°C
U1 = CMP-0321-00268-2: C129319; Manufacturer: Texas Instruments; Eco-Plan: Green (RoHS & no Sb/Br); Over Voltage Protection: N; Li-Ion: Y; SubFamily: Battery Charge Management; Vin(Min)(V): 4.3; Code_JEDEC: MO-220; ComponentLink1Description: Datasheet; Mounting Technology: Surface Mount; PartNumber: BQ24072TRGTR; Lead Acid: N; Li-Polymer: Y; NiMH: N; DatasheetVersion: SLUS937A; NiCd: N; ComponentLink1URL: http://www.ti.com/general/docs/lit/getliterature.tsp?genericPartNumber=BQ24072T&fileType=pdf; PackageDescription: 16-Pin Plastic Quad Flat No-Lead, 3 x 3 mm Body, 0.5 mm Pitch, 1.7 x 1.7 mm Exposed Pad; PackageReference: RGT0016C; PackageVersion: revH, Oct-2011
U5 U8 U10 = CMP-04918-000005-1: C2845237; Manufacturer: Texas Instruments; Nominal Supply Current: 11uA; Max Junction Temp: +125°C; Max Supply Voltage: 5.5V; Switching Topology: Buck-Boost; Min Supply Voltage: 1.3V; Output Current: 2A; Output Voltage: 1.8-5.2V; Number Of Outputs: 1; Switching Frequency: 1.4/1.6/2.1MHz; Standoff Height: 0mm; Max Duty Cycle: 100%; Output Type: AdjustableProgrammable; Manufacturer Part Number: TPS63802DLAR; ComponentLink2URL: https://www.ti.com/lit/ds/symlink/tps63802.pdf; Digikey Description: IC POWER MANAGEMENT; Octopart: https://octopart.com/tps63802dlar-texas+instruments-97359678; Height: 1mm; Temperature: -40°C to +125°C; Device Class L3: Voltage Regulators - Switching; Lead Free: Yes; Category: IC; Mouser Description: 2-A, high-efficient, 11-µA quiescent current buck-boost converter in QFN/DFN package 10-VSON-HR -40 to 125; ComponentLink2Description: Datasheet; Temperature Range Low: -40°C; Temperature Range High: +125°C; Automotive: No; Device Class L2: Power Management ICs; RoHS: TRUE; Device Class L1: Integrated Circuits (ICs); Package: DLA0010A
U6 U7 = CMP-04918-000715-1: C2693497; Output Configuration: Positive; Max Input Voltage: 5.5V; Number of Outputs: 1; Min Output Voltage: 600mV; Output Type: Adjustable; Max Output Voltage: 4V; Switching Frequency: 2.2MHz; Min Input Voltage: 2.4V; Synchronous Rectifier: Yes; Output Current: 3A; Min Operating Temperature: -40°C; Series: -; RoHS Compliant: Yes; Mount: Surface Mount; Number of Pins: 8; Packaging: Cut Tape; Max Operating Temperature: 125°C
USBC1 = type-c-31-m-12: C165948; Manufacturer: 韩国韩荣; AddInBom: yes; ModelId: 8421221a464047838322348b3a9debc3; ModelName: USB-C_SMD-TYPE-C-31-M-12_1; ModelTransform: 351.9678,311.023,0,180,0,0,0,-43.307,-33.465; Connector Type: Type-C; Gender: Female; Number of Contacts: 16P; Number of Ports: 1; Current Rating-Power: 5A; Voltage Rating: 20V; Connect-Disconnect Life: 10,000 cycles; Symbol: TYPE-C-31-M-12; LCSC Part Name: Type-C 母 卧贴; SupplierPart: C165948; ManufacturerPart: TYPE-C-31-M-12; Supplier Footprint: SMD; JLCPCB Part Class: Extended Part; Datasheet: https://item.szlcsc.com/datasheet/TYPE-C-31-M-12/177331.html; Supplier: LCSC; ConvertToPcb: yes; FootprintName: USB-C_SMD-TYPE-C-31-M-12_1; Protocol Standard: -; Mounting Type: Surface Mount, Right Angle; Length: 7.35mm; Operating Temperature: -30℃~+80℃

## Sheet FLASH.SchDoc
size A2; SheetNumber: 3; SheetTotal: 8
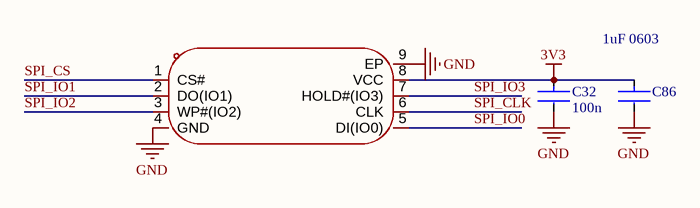
[diagram p2: FLASH.SchDoc]

### Parts
C32  100n  [CAP_0402]
C86  1uF 0603  [FP-GRM188-0_15-MFG]
U16  w25n02kvzeir  [w25n02]  (value not drawn)

### Nets
3V3: C32.1 C86.1 U16.8(VCC)
GND: C32.2 C86.2 U16.4(GND) U16.9(EP)
SPI_CLK: U16.6(CLK)
SPI_CS: U16.1(CS#)
SPI_IO0: U16.5(DI(IO0))
SPI_IO1: U16.2(DO(IO1))
SPI_IO2: U16.3(WP#(IO2))
SPI_IO3: U16.7(HOLD#(IO3))

### Library data of the parts
C32 = CMP-03422-001116-1: as C23 on sheet LEAKCAM; Max Operating Temperature: 125°C; Case Code (Metric): 1005; RoHS Compliant: Yes; Series: -; Case Code (Imperial): 0402; Min Operating Temperature: -55°C; Mount: Surface Mount; Case/Package: 0402; Packaging: Cut Tape
C86 = CMP-06035-003612-1: C15849; Tolerance: 20%; Dielectric: X5R; Voltage Rating: 10V; Material: Ceramic; Package Quantity: 4000; Width: 0.8mm; Case/Package: 0603; Thickness: 0.035inch; Capacitance: 1uF; Voltage Rating (DC): 10V; Termination: SMD/SMT; Length: 1.6mm; Lead Free: Lead Free; Mount: Surface Mount; Height: 0.8mm; Depth: 0.8mm; Packaging: Tape and Reel; Weight: 0.000222oz; Min Operating Temperature: -55°C; Case Code (Metric): 1608; Max Operating Temperature: 85°C; Case Code (Imperial): 0603; Value: 1uF
U16 = w25n02kvzeir: C17626844; Manufacturer: Winbond(华邦); AddInBom: yes; ModelId: 9e5cc5bccb2d4d2ba04b587249e4c285; ModelName: WSON-8_L8.0-W6.0-P1.27-TL-EP-1; ModelTransform: 314.96,236.22,0,0,0,0,0,0,0; Memory Size: 2Gbit; Interface: SPI; Clock Frequency: 104MHz; Voltage - Supply: 2.7V~3.6V; Page Program time (TPP): 700us; Block Erase Time(tBE): 2ms; Data Retention - TDR (Year): 10 Years; Standby Supply Current: 10uA; Program / Erase Cycles: 60,000 Cycles; Symbol: W25N02KVZEIR; LCSC Part Name: 支持双路/四路SPI、缓冲读取和顺序读取的SPI NAND闪存; SupplierPart: C3010298; ManufacturerPart: W25N02KVZEIR; Supplier Footprint: WSON-8-EP(6x8); JLCPCB Part Class: Extended Part; Datasheet: https://item.szlcsc.com/datasheet/W25N02KVZEIR/3508597.html; Supplier: LCSC; ConvertToPcb: yes; FootprintName: WSON-8_L8.0-W6.0-P1.27-TL-EP-1; Write Cycle Time(tWC): -; Operating Temperature: -40℃~+85℃

## Sheet DBG.SchDoc
size A2; SheetNumber: 4; SheetTotal: 8
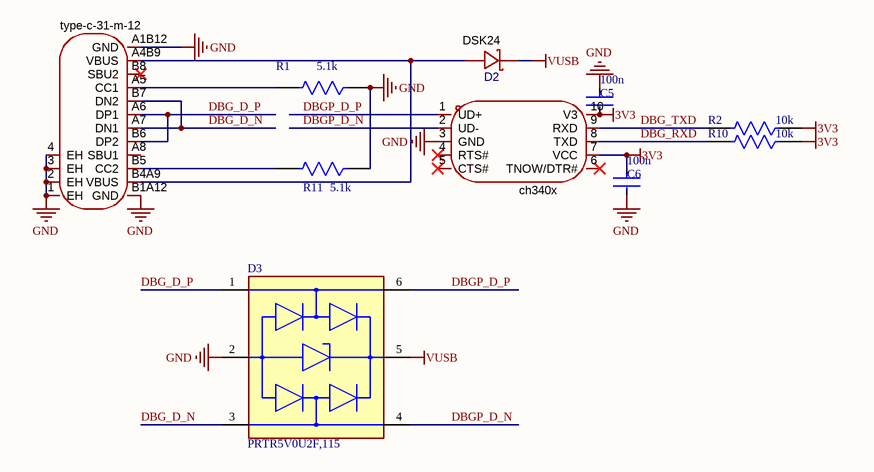
[diagram p3: DBG.SchDoc]

### Parts
C5  100n  [CAP_0402]
C6  100n  [CAP_0402]
D2  DSK24  [DSK24]
D3  PRTR5V0U2F,115  [FP-SOT886-MFG]
R1  5.1k  [RES_0402]
R2  10k  [RES_0402]
R10  10k  [RES_0402]
R11  5.1k  [RES_0402]
U2  ch340x  [ch340x]
USBC2  type-c-31-m-12  [TYPE-C-31-M-12]

### Nets
3V3: C5.2 C6.1 R2.1 R10.1 U2.7(VCC) U2.10(V3)
GND: C5.1 C6.2 D3.2(GND) R1.1 R11.1 U2.3(GND) USBC2.1(EH) USBC2.2(EH) USBC2.3(EH) USBC2.4(EH) USBC2.A1B12(GND) USBC2.B1A12(GND)
VUSB: D2.1(K) D3.5(VCC)
DBG_D_N: D3.3(I/O2) USBC2.A7(DN1) USBC2.B7(DN2)
DBG_D_P: D3.1(I/O1) USBC2.A6(DP1) USBC2.B6(DP2)
DBG_RXD: R10.2 U2.8(TXD)
DBG_TXD: R2.2 U2.9(RXD)
DBGP_D_N: D3.4(I/O2) U2.2(UD-)
DBGP_D_P: D3.6(I/O1) U2.1(UD+)
NetD2_2: D2.2(A) USBC2.A4B9(VBUS) USBC2.B4A9(VBUS)
NetR1_2: R1.2 USBC2.A5(CC1)
NetR11_2: R11.2 USBC2.B5(CC2)

Not connected (* = marked no-connect by the designer): U2 4(RTS#)* 5(CTS#)* 6(TNOW/DTR#)*; USBC2 A8(SBU1) B8(SBU2)*

### Library data of the parts
C5 C6 = CMP-03422-001116-1: as C23 on sheet LEAKCAM; Max Operating Temperature: 125°C; Case Code (Metric): 1005; RoHS Compliant: Yes; Series: -; Case Code (Imperial): 0402; Min Operating Temperature: -55°C; Mount: Surface Mount; Case/Package: 0402; Packaging: Cut Tape
D2 = dsk24_c64890: C22466352; Manufacturer: MDD(辰达半导体); Symbol: DSK24 K24; AddInBom: yes; ModelId: 560a7cf99d0e44cb9af362aaf5d7923d; ModelName: SOD-123_L2.8-W1.8-LS3.7-RD; ModelTransform: 144.8816,62.992,0,0,0,0,0,0,0; Diode Configuration: Independent; Voltage - Forward(Vf@If): 550mV@2A; Voltage - DC Reverse(Vr): 40V; Current - Rectified: 2A; Reverse Leakage Current (Ir): 500uA@40V; Operating Junction Temperature Range: -55℃~+150℃; LCSC Part Name: 电压:40V 电流:2A; SupplierPart: C64890; ManufacturerPart: DSK24; Supplier Footprint: SOD-123FL; JLCPCB Part Class: Extended Part; Datasheet: https://item.szlcsc.com/datasheet/DSK24/65960.html; Supplier: LCSC; ConvertToPcb: yes; FootprintName: SOD-123_L2.8-W1.8-LS3.7-RD
D3 = CMP-14436-000003-1: as D5 on sheet POWER; Octopart: https://octopart.com/prtr5v0u2f%2C115-nexperia-78741690; Height: 0.5mm; Category: Diode; RoHS: TRUE; Automotive: Yes; Digikey Description: TVS DIODE 5.5V 6XSON SOT886; Device Class L1: Circuit Protection; Ambient Temperature Range High: +85°C; ComponentLink2Description: Datasheet; Manufacturer Part Number: PRTR5V0U2F,115; Device Class L3: unset; Footprint Url: https://assets.nexperia.com/documents/outline-drawing/SOT886.pdf; Lead Free: Yes; Ambient Temperature Range Low: -40°C; Device Class L2: TVS Diodes; Package: SOT886; ComponentLink2URL: https://assets.nexperia.com/documents/data-sheet/PRTR5V0U2F_PRTR5V0U2K.pdf
R1 R11 = CMP-03412-016018-1: as R4 on sheet POWER; Ratings: AEC-Q200; Resistor Type: Thick Film; Number of Terminations: 2; RoHS Compliant: Yes; Min Operating Temperature: -55°C; Case/Package: 0402; Series: AC; Length: 0.039inch; Width: 0.02inch; Features: Moisture Resistant; Height: 0.015inch; Packaging: Tape and Reel; Max Operating Temperature: 155°C
R2 R10 = CMP-03412-016018-1: as R31 on sheet LEAKCAM; Ratings: AEC-Q200; Resistor Type: Thick Film; Number of Terminations: 2; RoHS Compliant: Yes; Min Operating Temperature: -55°C; Case/Package: 0402; Series: AC; Length: 0.039inch; Width: 0.02inch; Features: Moisture Resistant; Height: 0.015inch; Packaging: Tape and Reel; Max Operating Temperature: 155°C
U2 = ch340x: C3035748; Manufacturer: WCH(南京沁恒); AddInBom: yes; ModelId: 875cf331c88d40d1aea94374997f39b1; ModelName: MSOP-10_L3.0-W3.0-H1.1-LS5.0-P0.50; ModelTransform: 118.11,196.85,0,0,0,0,0,0,0; Applications Function: USB to serial；USB to Parallel; USB Protocol: USB 2.0; Voltage - Supply: 3.3V；5V; Data Rate: 2Mbps; Symbol: CH340X; Supplier: LCSC; Supplier Part: C3035748; Manufacturer Part: CH340X; JLCPCB Part Class: Extended Part; LCSC Part Name: CH340X; Supplier Footprint: MSOP-10; Datasheet: https://item.szlcsc.com/datasheet/CH340X/3584030.html; ConvertToPcb: yes; FootprintName: MSOP-10_L3.0-W3.0-P0.50-LS5.0-BL; Number of Channels: -; Operating Temperature: -20℃~+70℃; Current - Supply: -; Quiescent Supply Current: -
USBC2 = type-c-31-m-12: as USBC1 on sheet POWER; Symbol: TYPE-C-31-M-12; LCSC Part Name: Type-C 母 卧贴; SupplierPart: C165948; ManufacturerPart: TYPE-C-31-M-12; Supplier Footprint: SMD; JLCPCB Part Class: Extended Part; Datasheet: https://item.szlcsc.com/datasheet/TYPE-C-31-M-12/177331.html; Supplier: LCSC; ConvertToPcb: yes; FootprintName: USB-C_SMD-TYPE-C-31-M-12_1; Protocol Standard: -; Mounting Type: Surface Mount, Right Angle; Length: 7.35mm; Operating Temperature: -30℃~+80℃

## Sheet CAM.SchDoc
size A2; SheetNumber: 5; SheetTotal: 8
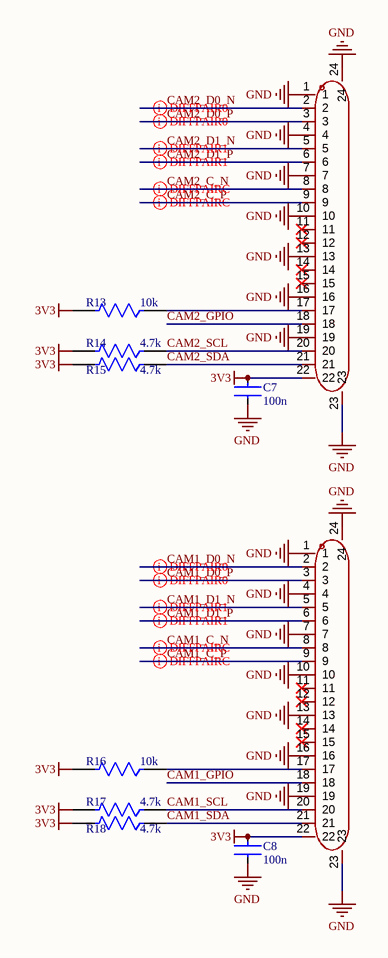
[diagram p4: CAM.SchDoc]

### Parts
C7  100n  [CAP_0402]
C8  100n  [CAP_0402]
J4  05b20l22p  [FLEX_CON_22P]  (value not drawn)
J5  05b20l22p  [FLEX_CON_22P]  (value not drawn)
R13  10k  [RES_0402]
R14  4.7k  [RES_0402]
R15  4.7k  [RES_0402]
R16  10k  [RES_0402]
R17  4.7k  [RES_0402]
R18  4.7k  [RES_0402]

### Nets
3V3: C7.1 C8.1 J4.22 J5.22 R13.2 R14.2 R15.2 R16.2 R17.2 R18.2
GND: C7.2 C8.2 J4.1 J4.4 J4.7 J4.10 J4.13 J4.16 J4.19 J4.23 J4.24 J5.1 J5.4 J5.7 J5.10 J5.13 J5.16 J5.19 J5.23 J5.24
CAM1_C_N: J5.8
CAM1_C_P: J5.9
CAM1_D0_N: J5.2
CAM1_D0_P: J5.3
CAM1_D1_N: J5.5
CAM1_D1_P: J5.6
CAM1_GPIO: J5.18
CAM1_SCL: J5.20 R17.1
CAM1_SDA: J5.21 R18.1
CAM2_C_N: J4.8
CAM2_C_P: J4.9
CAM2_D0_N: J4.2
CAM2_D0_P: J4.3
CAM2_D1_N: J4.5
CAM2_D1_P: J4.6
CAM2_GPIO: J4.18
CAM2_SCL: J4.20 R14.1
CAM2_SDA: J4.21 R15.1
NetJ4_17: J4.17 R13.1
NetJ5_17: J5.17 R16.1

Not connected (* = marked no-connect by the designer): J4 11* 12* 14* 15*; J5 11* 12* 14* 15*

### Layout directives
differential pair; differential pair class CAM0: CAM1_D0_N, CAM1_D0_P, CAM2_D0_N, CAM2_D0_P
differential pair; differential pair class CAM1: CAM1_D1_N, CAM1_D1_P, CAM2_D1_N, CAM2_D1_P
differential pair; differential pair class CAMC: CAM1_C_N, CAM1_C_P, CAM2_C_N, CAM2_C_P

### Library data of the parts
C7 C8 = CMP-03422-001116-1: as C23 on sheet LEAKCAM; Max Operating Temperature: 125°C; Case Code (Metric): 1005; RoHS Compliant: Yes; Series: -; Case Code (Imperial): 0402; Min Operating Temperature: -55°C; Mount: Surface Mount; Case/Package: 0402; Packaging: Cut Tape
J4 J5 = 05b20l22p: C22459552; Manufacturer: HanElectricity(瀚源); AddInBom: yes; Locking Feature: Slide Lock; Number of Contacts: 22P; Pitch: 0.5mm; FFC, FCB Thickness: 0.3mm; Rated Voltage (Max): 50V; Current Rating (Max): 400mA; LCSC Part Name: 抽屉式 下接 P数:22P 间距:0.5mm; SupplierPart: C22459552; ManufacturerPart: 05B20L22P; Supplier Footprint: SMD,P=0.5mm,卧贴; JLCPCB Part Class: Extended Part; Datasheet: https://item.szlcsc.com/datasheet/05B20L22P/24136208.html; Supplier: LCSC; ConvertToPcb: yes; SymbolName: 05B20L22P; FootprintName: CONN-SMD_05B20L22P; Contact Type: Bottom Contact; Mounting Type: Surface Mount, Right Angle; Height Above Board: 2mm; Contact Material: Phosphor bronze; Contact Plating: Tin; Operating Temperature: -25℃~+85℃
R13 R16 = CMP-03412-016018-1: as R31 on sheet LEAKCAM; Ratings: AEC-Q200; Resistor Type: Thick Film; Number of Terminations: 2; RoHS Compliant: Yes; Min Operating Temperature: -55°C; Case/Package: 0402; Series: AC; Length: 0.039inch; Width: 0.02inch; Features: Moisture Resistant; Height: 0.015inch; Packaging: Tape and Reel; Max Operating Temperature: 155°C
R14 R15 R17 R18 = CMP-03412-016018-1: C25900; Tolerance: 1%; Temperature Coefficient: 100ppm/°C; Resistance: 4.7kOhm; Max Power Dissipation: 63mW; Value: 4.7kOhm; Ratings: AEC-Q200; Resistor Type: Thick Film; Number of Terminations: 2; RoHS Compliant: Yes; Min Operating Temperature: -55°C; Case/Package: 0402; Series: AC; Length: 0.039inch; Width: 0.02inch; Features: Moisture Resistant; Height: 0.015inch; Packaging: Tape and Reel; Max Operating Temperature: 155°C